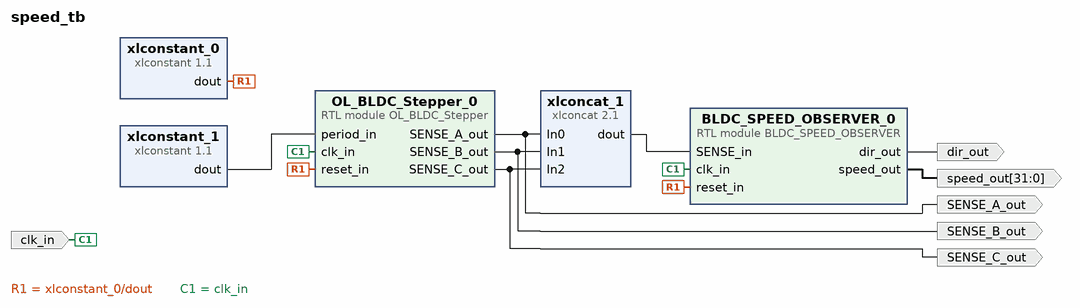
[diagram p0: block diagram of the top level]
# Vivado block design speed_tb, xc7z010clg225-1, Vivado 2016.3
create_bd_design speed_tb

create_bd_port -dir O dir_out
create_bd_port -dir O -from 31 -to 0 speed_out
create_bd_port -dir I clk_in
create_bd_port -dir O SENSE_A_out
create_bd_port -dir O SENSE_B_out
create_bd_port -dir O SENSE_C_out

create_bd_cell -type ip -vlnv xilinx.com:ip:xlconcat:2.1 xlconcat_1
set_property -dict {CONFIG.NUM_PORTS 3 CONFIG.IN0_WIDTH 1 CONFIG.IN1_WIDTH 1 CONFIG.IN2_WIDTH 1} [get_bd_cells xlconcat_1]
create_bd_cell -type ip -vlnv xilinx.com:ip:xlconstant:1.1 xlconstant_0
set_property -dict {CONFIG.CONST_VAL 0} [get_bd_cells xlconstant_0]
create_bd_cell -type ip -vlnv xilinx.com:ip:xlconstant:1.1 xlconstant_1
set_property -dict {CONFIG.CONST_WIDTH 24 CONFIG.CONST_VAL 255} [get_bd_cells xlconstant_1]
create_bd_cell -type module -reference OL_BLDC_Stepper OL_BLDC_Stepper_0
create_bd_cell -type module -reference BLDC_SPEED_OBSERVER BLDC_SPEED_OBSERVER_0

# ---- connections ----

connect_bd_net [get_bd_pins xlconcat_1/dout] [get_bd_pins BLDC_SPEED_OBSERVER_0/SENSE_in]
connect_bd_net [get_bd_pins xlconstant_0/dout] [get_bd_pins OL_BLDC_Stepper_0/reset_in] [get_bd_pins BLDC_SPEED_OBSERVER_0/reset_in]
connect_bd_net [get_bd_pins xlconstant_1/dout] [get_bd_pins OL_BLDC_Stepper_0/period_in]
connect_bd_net [get_bd_pins BLDC_SPEED_OBSERVER_0/dir_out] [get_bd_ports dir_out]
connect_bd_net [get_bd_pins BLDC_SPEED_OBSERVER_0/speed_out] [get_bd_ports speed_out]
connect_bd_net [get_bd_ports clk_in] [get_bd_pins OL_BLDC_Stepper_0/clk_in] [get_bd_pins BLDC_SPEED_OBSERVER_0/clk_in]
connect_bd_net [get_bd_pins OL_BLDC_Stepper_0/SENSE_A_out] [get_bd_ports SENSE_A_out] [get_bd_pins xlconcat_1/In0]
connect_bd_net [get_bd_pins OL_BLDC_Stepper_0/SENSE_B_out] [get_bd_ports SENSE_B_out] [get_bd_pins xlconcat_1/In1]
connect_bd_net [get_bd_pins OL_BLDC_Stepper_0/SENSE_C_out] [get_bd_ports SENSE_C_out] [get_bd_pins xlconcat_1/In2]

validate_bd_design
save_bd_design
